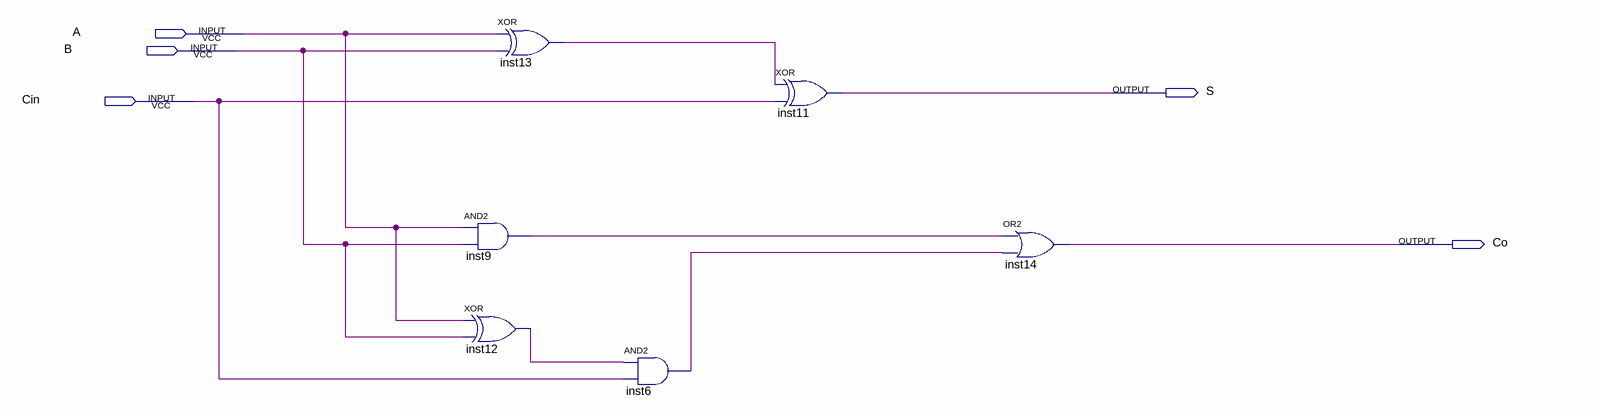
[diagram p0: schematic sheet]
// Quartus schematic additionneur.bdf as structural Verilog: 6 symbols, 5 pins
module additionneur (
  input  A,
  input  B,
  input  Cin,
  output S,
  output Co
);

  wire inst6_out, inst9_out, inst12_out, inst13_out;

  and inst9 (inst9_out, A, B);
  xor inst12 (inst12_out, A, B);
  xor inst13 (inst13_out, A, B);
  and inst6 (inst6_out, inst12_out, Cin);
  xor inst11 (S, inst13_out, Cin);
  or inst14 (Co, inst9_out, inst6_out);
endmodule
